# EAGLE design distance_sensor (EAGLE 8.0.2)
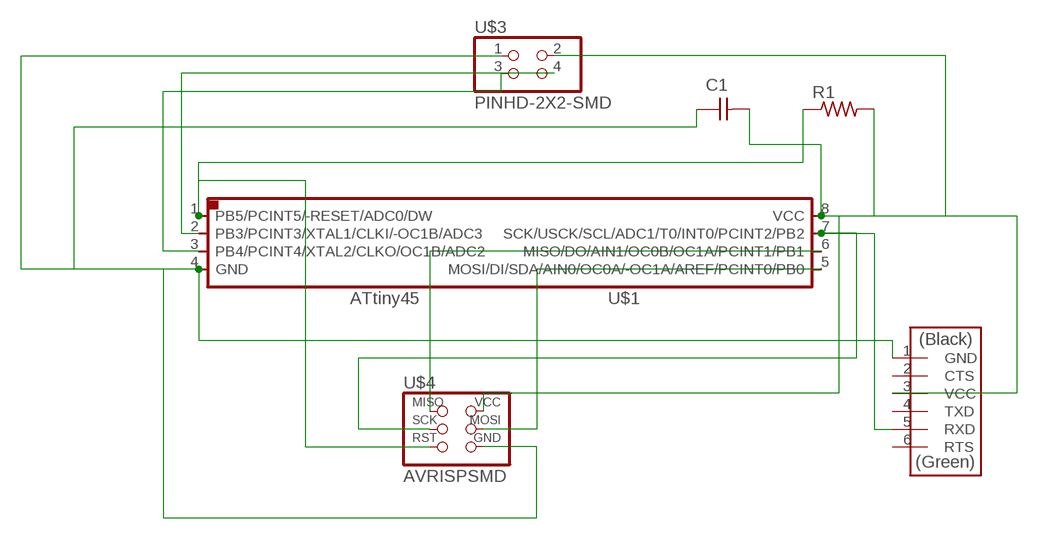
[diagram p0: schematic, sheet 1]

## Parts
C1  CAP-UNPOLARIZEDFAB  [C1206FAB]
R1  RES-US1206FAB  [R1206FAB]
U$1  ATTINY45SI  [SOIC8]
U$2  FTDI-SMD-HEADER  [1X06SMD]
U$3  PINHD-2X2-SMD  [2X02SMD]
U$4  AVRISPSMD  [2X03SMD]

## Nets
N$1: C1.1 U$1.4(GND) U$2.1(GND) U$3.1 U$4.6(GND)
N$2: C1.2 R1.2 U$1.8(VCC) U$2.3(VCC) U$3.2 U$4.2(VCC)
N$3: U$1.7(SCK/USCK/SCL/ADC1/T0/INT0/PCINT2/PB2) U$2.5(RXD) U$4.3(SCK)
N$4: U$1.3(PB4/PCINT4/XTAL2/CLKO/OC1B/ADC2) U$3.3
N$5: U$1.2(PB3/PCINT3/XTAL1/CLKI/-OC1B/ADC3) U$3.4
N$6: U$1.6(MISO/DO/AIN1/OC0B/OC1A/PCINT1/PB1) U$4.1(MISO)
N$7: U$1.5(MOSI/DI/SDA/AIN0/OC0A/-OC1A/AREF/PCINT0/PB0) U$4.4(MOSI)
N$8: R1.1 U$1.1(PB5/PCINT5/-RESET/ADC0/DW) U$4.5(RST)
Unconnected: U$2.2(CTS) U$2.4(TXD) U$2.6(RTS)

## Library data of the parts
C1 = 01_fab:CAP-UNPOLARIZED
R1 = 01_fab:RES-US: Resistor (US Symbol) Variants with postfix FAB are widened to allow the routing of internal traces
U$1 = 01_fab:ATTINY45
U$2 = 01_fab:FTDI-SMD-HEADER
U$3 = 01_fab:PINHD-2X2-SMD
U$4 = 01_fab:AVRISP

## Board
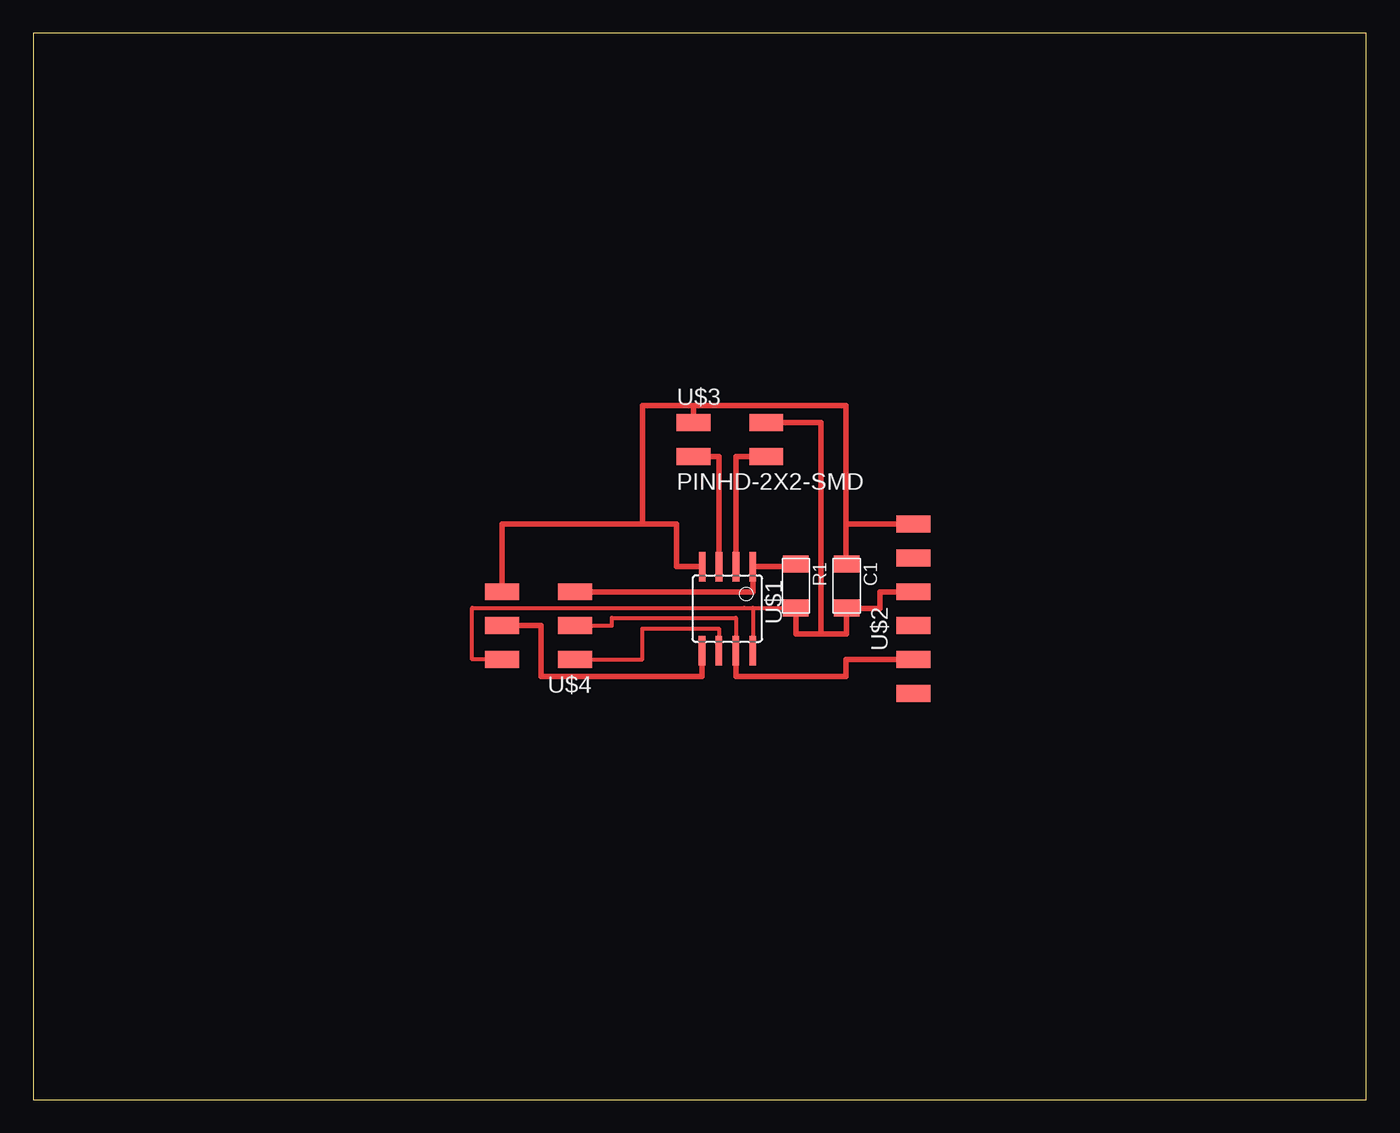
[diagram p1: board, top side]

Size 100 x 80 mm. Coordinates in mm from the lower left corner, seen from the top.
Outline: 0,0 100,0 100,80 0,80 0,0
Copper layers (1*16): Top 0.035mm / dielectric 1.5mm / Bottom 0.035mm
Design rules "default *": minimum track width 12mil, minimum drill 24mil, track to track 16mil, track to pad 16mil, pad to pad 16mil, via to via 16mil, smd to smd 16mil, copper to edge 40mil, drill to drill 8mil, minimum pad ring 10mil, minimum via ring 8mil, stop-mask expansion 4mil, vias tented up to drill 0mil, thermal gap 10mil

### Footprints (pad centres in the part's own frame; a part is rotated, then mirrored left to right if it is on the bottom)
C1206FAB = smd 1.27 x 1.905: 1 -1.651,0; 2 1.651,0
R1206FAB = smd 1.27 x 1.905: 1 -1.651,0; 2 1.651,0
SOIC8 = smd 0.5 x 2.2: 1 -1.905,-3.154; 2 -0.645,-3.154; 3 0.625,-3.154; 4 1.895,-3.154; 5 1.905,3.154; 6 0.635,3.154; 7 -0.635,3.154; 8 -1.905,3.154
1X06SMD = smd 2.54 x 1.27: 1 0,6.35; 2 0,3.81; 3 0,1.27; 4 0,-1.27; 5 0,-3.81; 6 0,-6.35
2X02SMD = smd 2.54 x 1.27: 1 -2.54,1.27; 2 2.92,1.27; 3 -2.54,-1.27; 4 2.92,-1.27
2X03SMD = smd 2.54 x 1.27: 1 -2.54,2.54; 2 2.92,2.54; 3 -2.54,0; 4 2.92,0; 5 -2.54,-2.54; 6 2.92,-2.54

### Placement (x,y rotation side)
C1  61.02,38.54 270 top
R1  57.21,38.54 270 top
U$1  52.07,36.83 180 top
U$2  66.04,36.83 0 top
U$3  52.07,49.53 0 top
U$4  38.1,35.56 180 top

### Tracks (layer width: path | path; a pad name or v marks a point on that pad's centre or on a via)
N$1
  Top 0.406: U$3.1 49.53,52.07 | 60.96,43.18 60.96,52.07 49.53,52.07 | U$4.6 35.18,43.18 45.72,43.18 | U$1.4 48.26,39.98 48.26,43.18 45.72,43.18 | 60.96,43.18 U$2.1 | C1.1 60.96,40.2 60.96,43.18 | 49.53,52.07 45.72,52.07 45.72,43.18
N$2
  Top 0.305: 53.34,36.89 32.92,36.89 32.92,33.02 U$4.2 | 53.34,36.89 53.98,36.89 U$1.8 | 53.34,36.89 R1.2
  Top 0.406: 59.09,34.95 59.09,50.8 U$3.2 | 57.21,36.83 R1.2 57.21,34.95 59.09,34.95 | U$2.3 63.5,38.1 63.5,36.83 61.02,36.83 C1.2 61.02,34.95 59.09,34.95
N$3
  Top 0.305: U$4.3 43.4,35.56 43.4,36.13 52.7,36.13 U$1.7
  Top 0.406: U$2.5 60.96,33.02 60.96,31.75 52.7,31.75 U$1.7
N$4
  Top 0.406: U$1.3 51.45,48.26 U$3.3
N$5
  Top 0.406: U$3.4 52.72,48.26 U$1.2
N$6
  Top 0.305: U$4.1 45.69,33.02 45.69,35.34 51.44,35.34 U$1.6
N$7
  Top 0.406: 50.16,34.29 U$1.5 50.16,31.75 38.1,31.75 38.1,35.56 U$4.4
N$8
  Top 0.406: U$4.5 53.98,38.1 U$1.1 57.21,39.98 R1.1